# EAGLE design AK4558EN_PMOD (EAGLE 9.6.1)

## Sheet 1 of 2
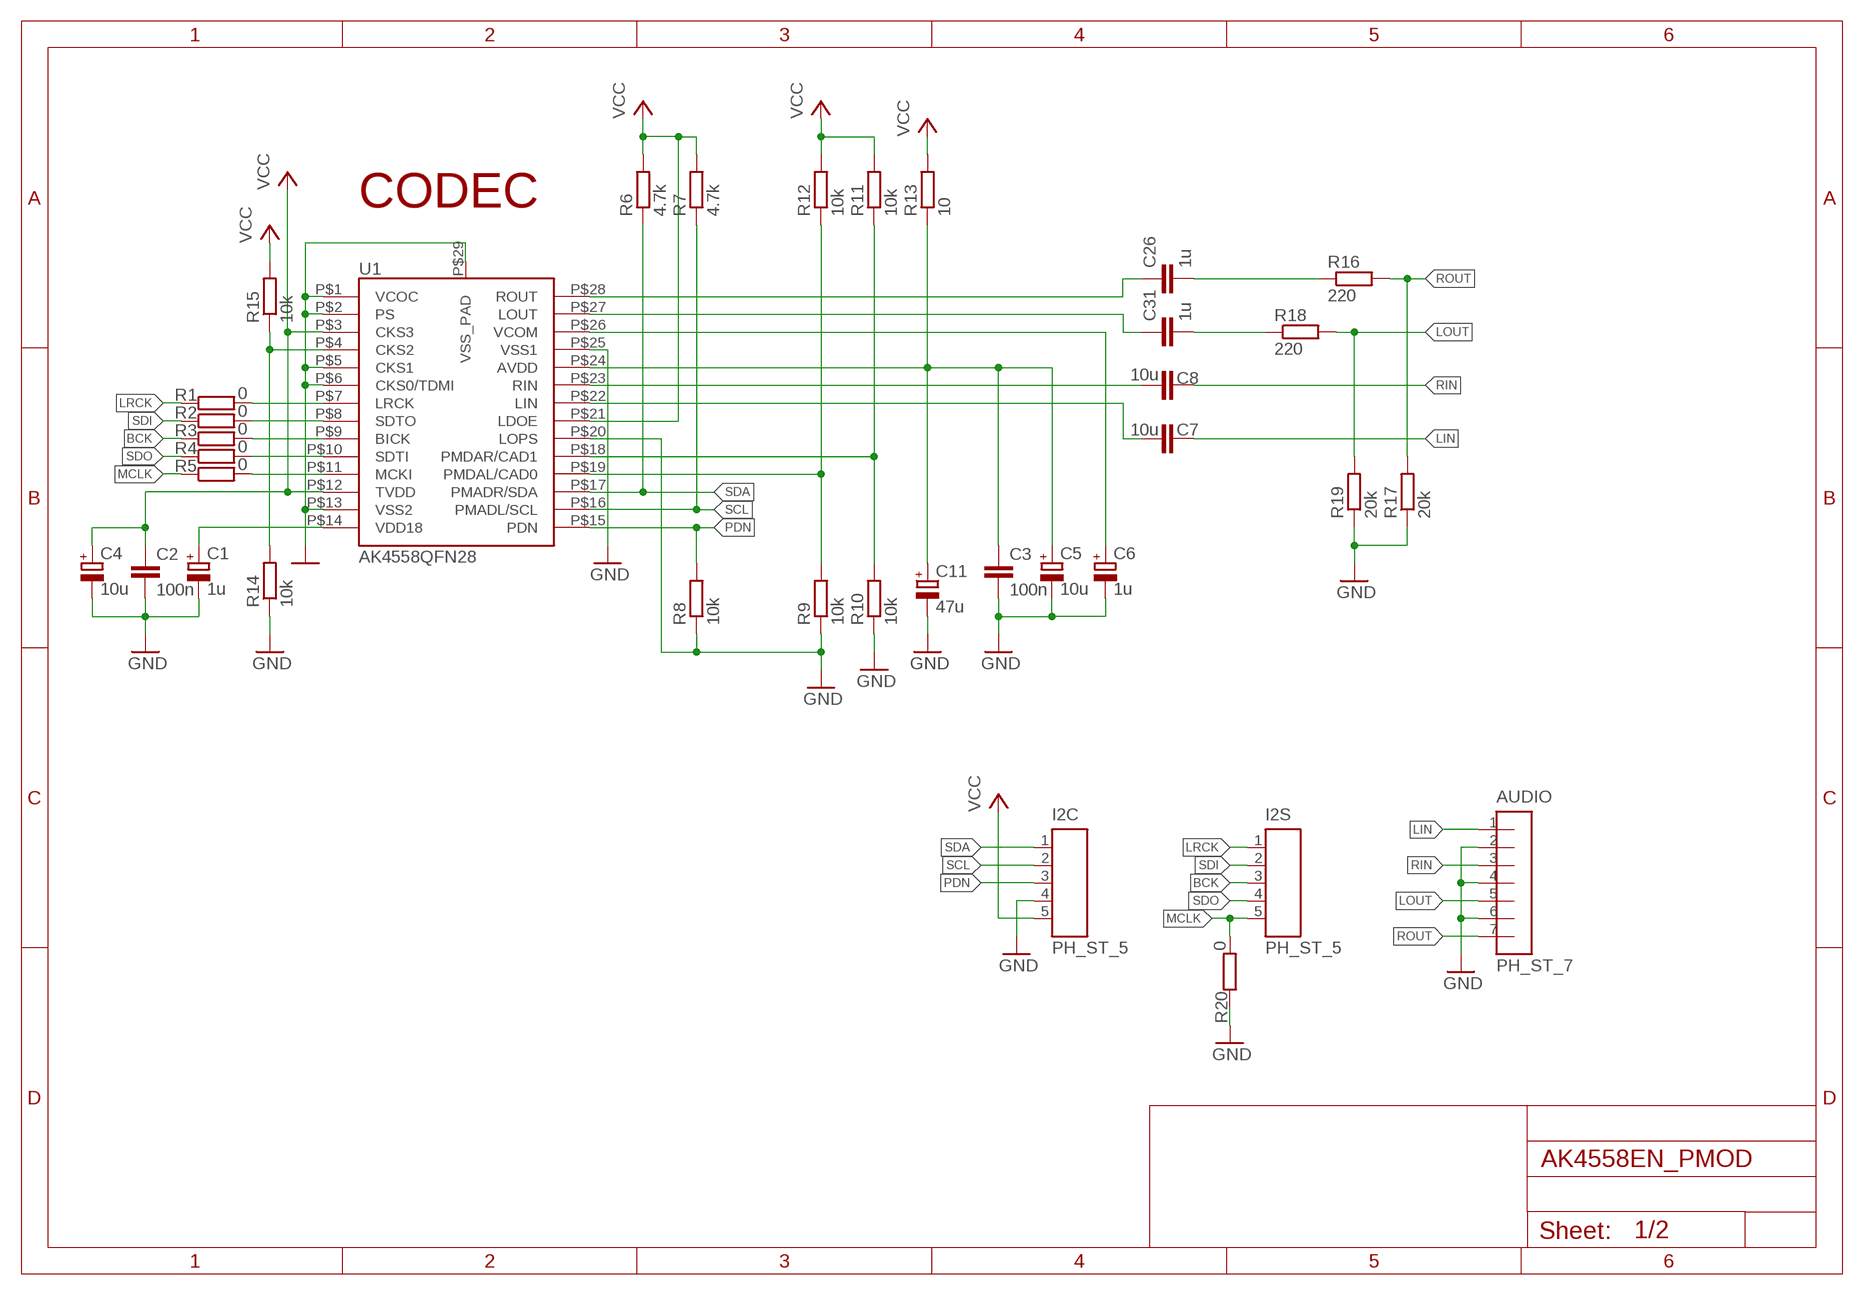
[diagram p0: schematic, sheet 1]

### Parts
AUDIO  PH_ST_7  [HDRV7W64P254_1X7_1016X508X838B]
C1  1u  CPOL-EUSMCA  [SMC_A]
C2  100n  C-EUC0603  [C0603]
C3  100n  C-EUC0603  [C0603]
C4  10u  CPOL-EUSMCB  [SMC_B]
C5  10u  CPOL-EUSMCB  [SMC_B]
C6  1u  CPOL-EUSMCA  [SMC_A]
C7  10u  C-EUC0603  [C0603]
C8  10u  C-EUC0603  [C0603]
C11  47u  CPOL-EUSMCC  [SMC_C]
C26  1u  C-EUC0603  [C0603]
C31  1u  C-EUC0603  [C0603]
I2C  PH_ST_5  [HDRV5W64P254_1X5_1016X508X838B]
I2S  PH_ST_5  [HDRV5W64P254_1X5_1016X508X838B]
R1  0  R-EU_R0603  [R0603]
R2  0  R-EU_R0603  [R0603]
R3  0  R-EU_R0603  [R0603]
R4  0  R-EU_R0603  [R0603]
R5  0  R-EU_R0603  [R0603]
R6  4.7k  R-EU_R0603  [R0603]
R7  4.7k  R-EU_R0603  [R0603]
R8  10k  R-EU_R0603  [R0603]
R9  10k  R-EU_R0603  [R0603]
R10  10k  R-EU_R0603  [R0603]
R11  10k  R-EU_R0603  [R0603]
R12  10k  R-EU_R0603  [R0603]
R13  10  R-EU_R0603  [R0603]
R14  10k  R-EU_R0603  [R0603]
R15  10k  R-EU_R0603  [R0603]
R16  220  R-EU_R0603  [R0603]
R17  20k  R-EU_R0603  [R0603]
R18  220  R-EU_R0603  [R0603]
R19  20k  R-EU_R0603  [R0603]
R20  0  R-EU_R0603  [R0603]
U1  AK4558QFN28  [QFN28_5X5]

### Nets
BCK: I2S.3 R3.1
CKS2: R14.2 R15.1 U1.P$4(CKS2)
CODEC_AVDD: C3.1 C5.+ C11.+ R13.1 U1.P$24(AVDD)
GND: AUDIO.2 AUDIO.4 AUDIO.6 C1.- C2.2 C3.2 C4.- C5.- C6.- C11.- I2C.4 R8.1 R9.1 R10.1 R14.1 R17.1 R19.1 R20.1 U1.P$1(VCOC) U1.P$2(PS) U1.P$5(CKS1) U1.P$6(CKS0/TDMI) U1.P$13(VSS2) U1.P$20(LOPS) U1.P$25(VSS1) U1.P$29(VSS_PAD)
LIN: AUDIO.1 C7.1
LOUT: AUDIO.5 R18.2 R19.2
LRCK: I2S.1 R1.1
MCLK: I2S.5 R5.1 R20.2
N$2: C7.2 U1.P$22(LIN)
N$3: C26.2 R16.1
N$4: C6.+ U1.P$26(VCOM)
N$5: R5.2 U1.P$11(MCKI)
N$6: C8.2 U1.P$23(RIN)
N$7: C31.1 U1.P$27(LOUT)
N$8: C31.2 R18.1
N$9: C26.1 U1.P$28(ROUT)
N$10: R10.2 R11.1 U1.P$18(PMDAR/CAD1)
N$11: R9.2 R12.1 U1.P$19(PMDAL/CAD0)
N$15: C1.+ U1.P$14(VDD18)
N$22: R1.2 U1.P$7(LRCK)
N$27: R2.2 U1.P$8(SDTO)
N$28: R3.2 U1.P$9(BICK)
N$30: R4.2 U1.P$10(SDTI)
PDN: I2C.3 R8.2 U1.P$15(PDN)
RIN: AUDIO.3 C8.1
ROUT: AUDIO.7 R16.2 R17.2
SCL: I2C.2 R7.1 U1.P$16(PMADL/SCL)
SDA: I2C.1 R6.1 U1.P$17(PMADR/SDA)
SDI: I2S.2 R2.1
SDO: I2S.4 R4.1
VCC: C2.1 C4.+ I2C.5 R6.2 R7.2 R11.2 R12.2 R13.2 R15.2 U1.P$3(CKS3) U1.P$12(TVDD) U1.P$21(LDOE)

### Notes on the sheet
- CODEC

## Sheet 2 of 2: ANALOG
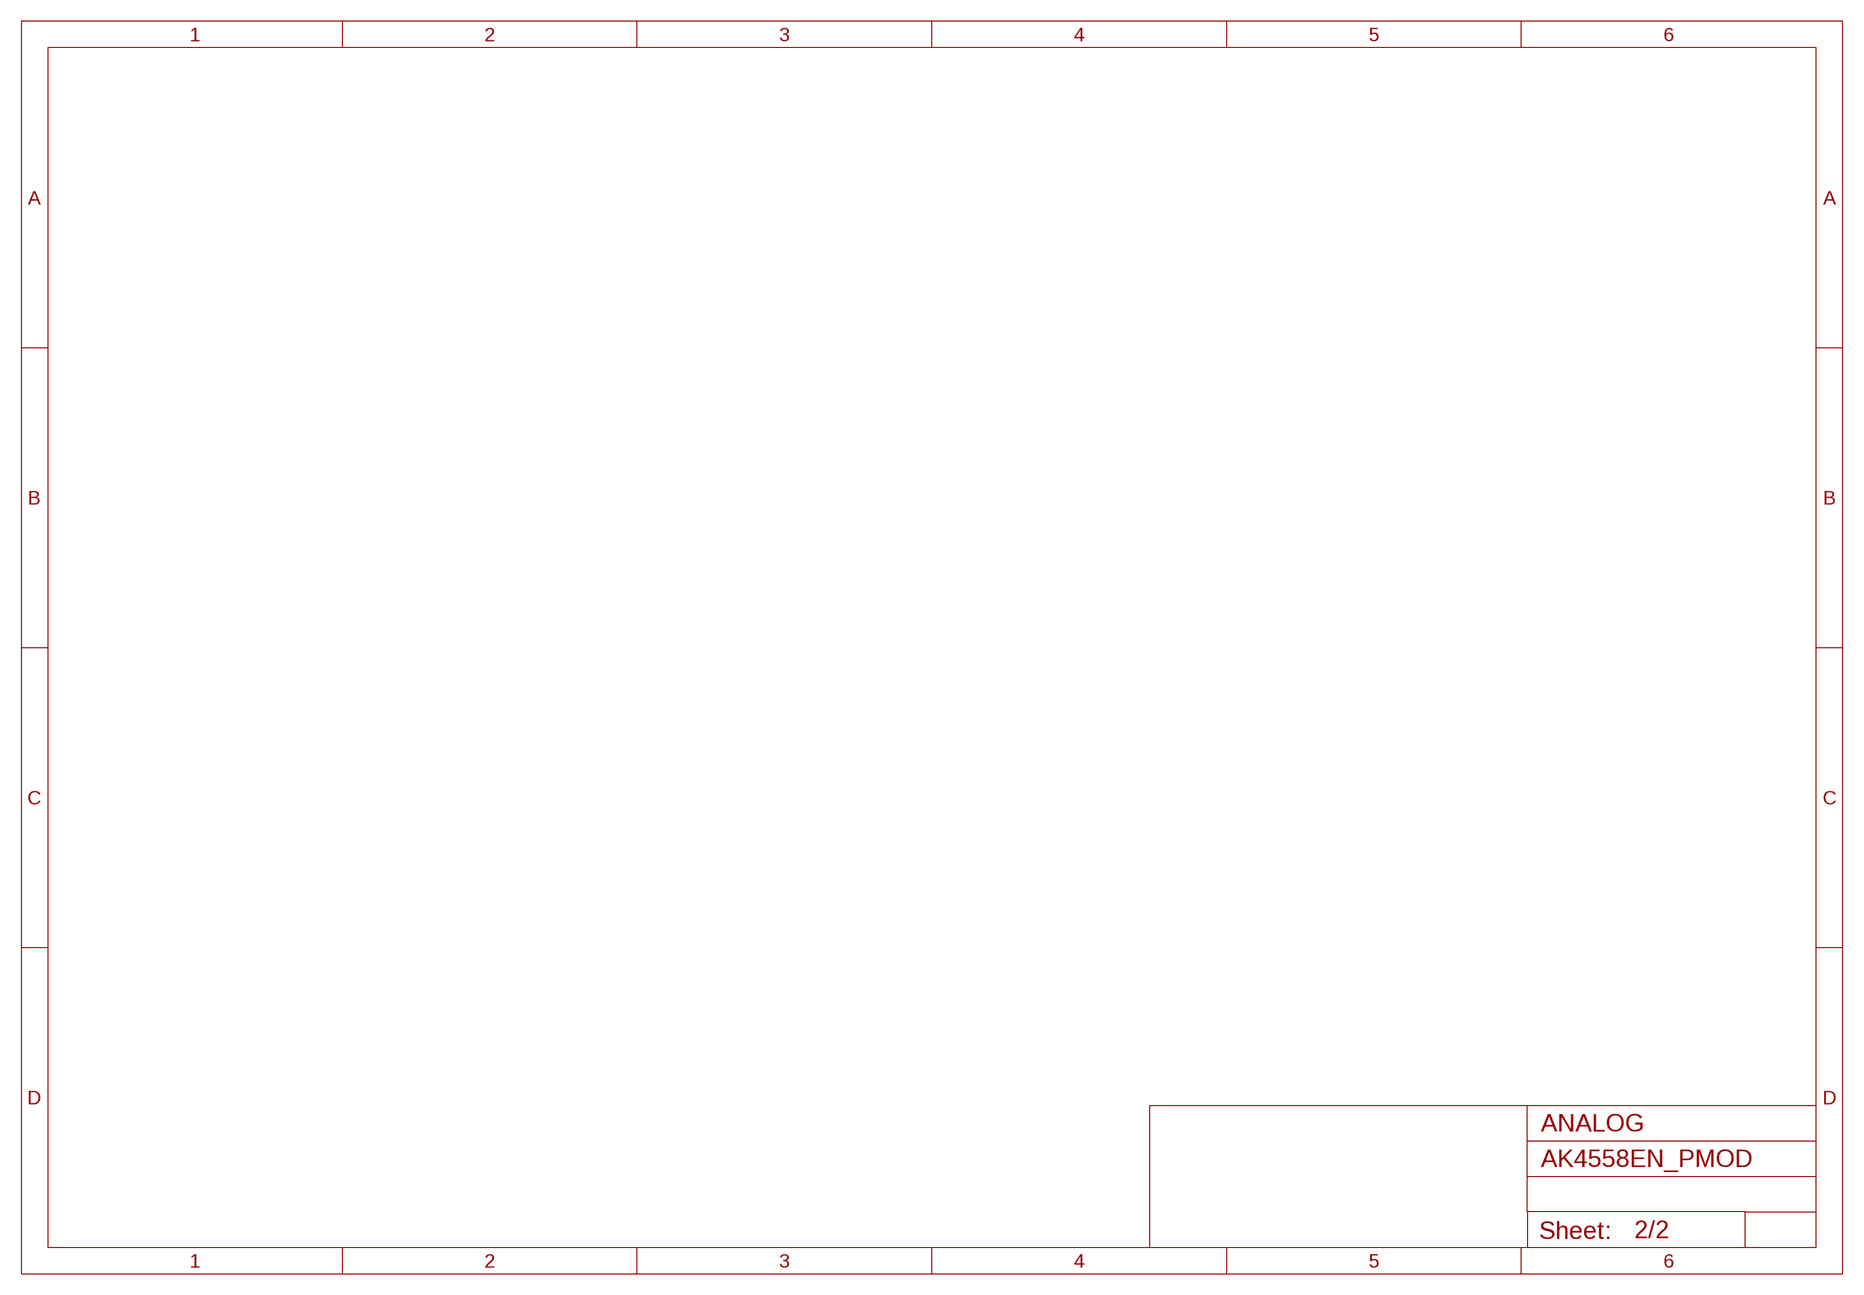
[diagram p1: schematic, sheet 2]

## Library data of the parts
AUDIO = AK4558EN_PMOD:PH_ST_7
C1 C4-C6 C11 = NuLib:CPOL-EU: POLARIZED CAPACITOR, European symbol; SPICEPREFIX: C
C2 C3 C7 C8 C26 C31 = rcl:C-EU: CAPACITOR, European symbol; SPICEPREFIX: C
I2C I2S = AK4558EN_PMOD:PH_ST_5
R1-R20 = rcl:R-EU_: RESISTOR, European symbol; SPICEPREFIX: R
U1 = HRA:AK4558

## Board
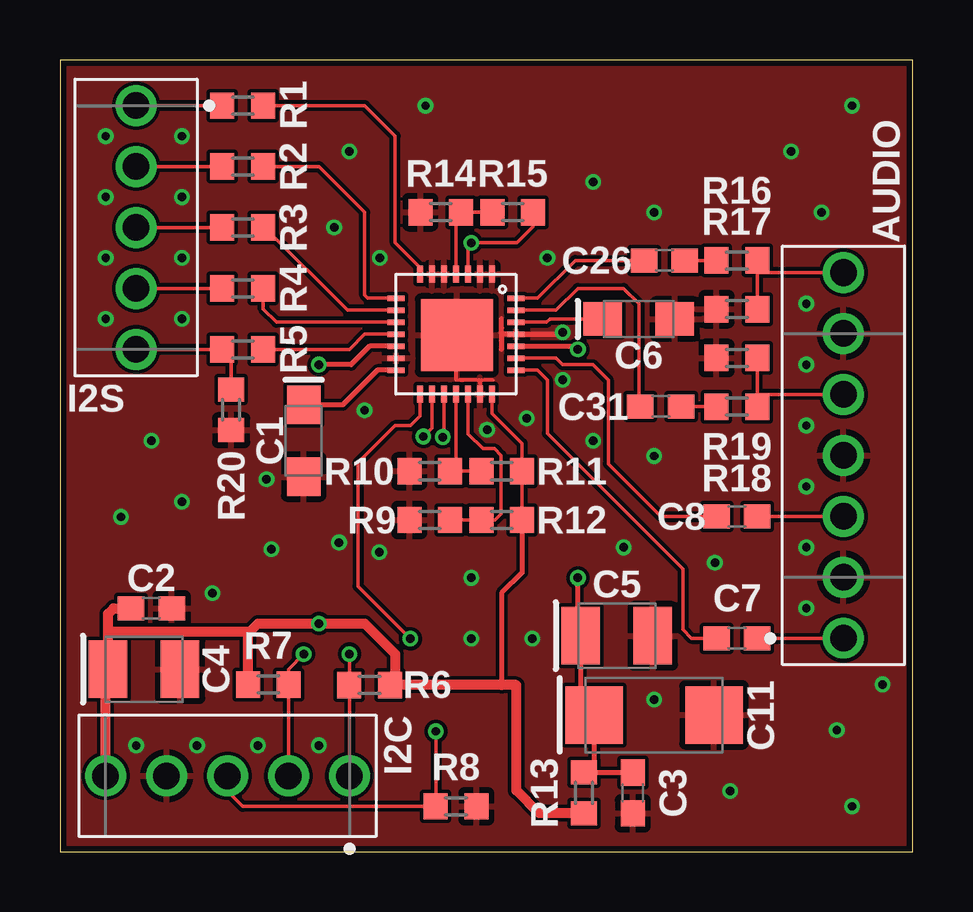
[diagram p2: board, top side]
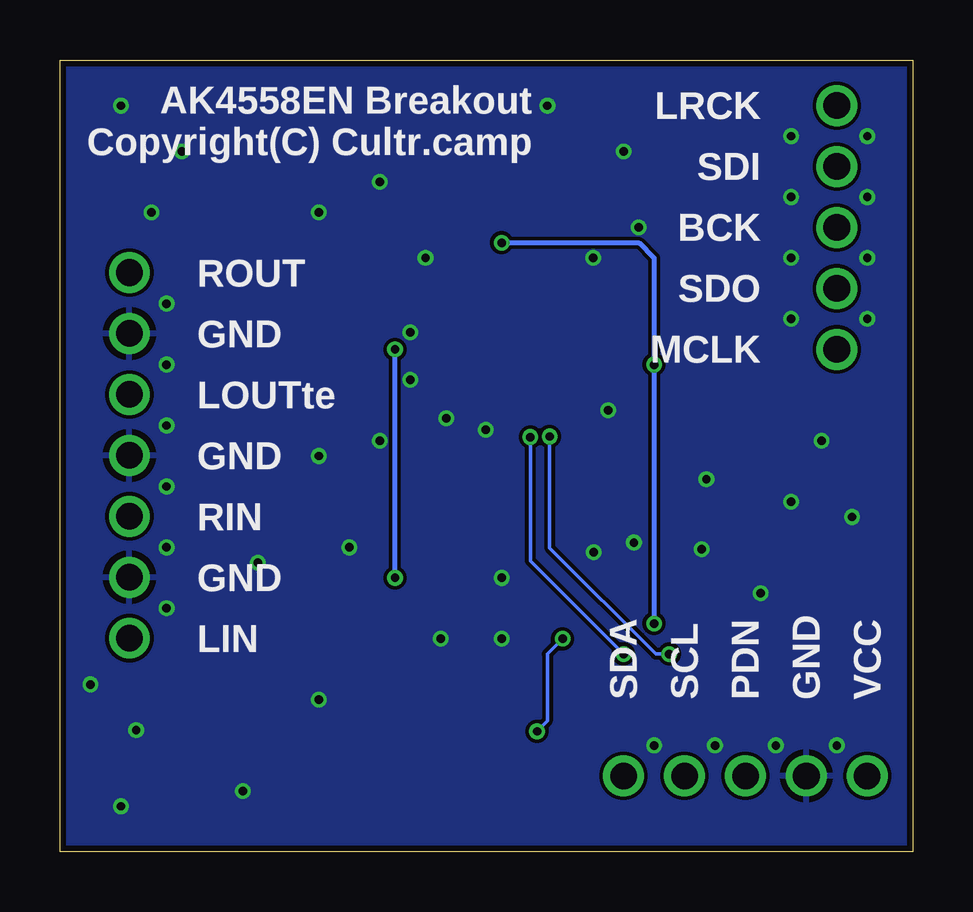
[diagram p3: board, bottom side, seen from below]

Size 35.56 x 33.02 mm. Coordinates in mm from the lower left corner, seen from the top.
Outline: 0,0 35.56,0 35.56,33.02 0,33.02 0,0
Copper layers (1*16): Top 0.035mm / dielectric 1.5mm / Bottom 0.035mm
Design rules "SeeedStudio_2layer_DRU_no_angle_20140221": minimum track width 6mil, minimum drill 12mil, track to track 6mil, track to pad 6mil, pad to pad 6mil, via to via 6mil, smd to smd 0mil, copper to edge 10mil, drill to drill 10mil, minimum pad ring 10mil, minimum via ring 6mil, stop-mask expansion 2mil, vias tented up to drill 100mil, thermal gap 10mil

### Footprints (pad centres in the part's own frame; a part is rotated, then mirrored left to right if it is on the bottom)
HDRV7W64P254_1X7_1016X508X838B = drill 1.105 pad 1.705: 1 0,0; 2 2.54,0; 3 5.08,0; 4 7.62,0; 5 10.16,0; 6 12.7,0; 7 15.24,0
SMC_A = smd 1.6 x 1.4: + -1.5,0; - 1.5,0
C0603 = smd 1.1 x 1: 1 -0.85,0; 2 0.85,0
SMC_B = smd 1.6 x 2.4: + -1.5,0; - 1.5,0
SMC_C = smd 2.4 x 2.4: + -2.5,0; - 2.5,0
HDRV5W64P254_1X5_1016X508X838B = drill 1.105 pad 1.705: 1 0,0; 2 2.54,0; 3 5.08,0; 4 7.62,0; 5 10.16,0
R0603 = smd 1 x 1.1: 1 -0.85,0; 2 0.85,0
QFN28_5X5 = smd 0.7 x 0.23: P$1 -2.5,1.5; P$2 -2.5,1; P$3 -2.5,0.5; P$4 -2.5,0; P$5 -2.5,-0.5; P$6 -2.5,-1; P$7 -2.5,-1.5; P$15 2.5,-1.5; P$16 2.5,-1; P$17 2.5,-0.5; P$18 2.5,0; P$19 2.5,0.5; P$20 2.5,1; P$21 2.5,1.5 | smd 0.23 x 0.7: P$8 -1.5,-2.5; P$9 -1,-2.5; P$10 -0.5,-2.5; P$11 0,-2.5; P$12 0.5,-2.5; P$13 1,-2.5; P$14 1.5,-2.5; P$22 1.5,2.5; P$23 1,2.5; P$24 0.5,2.5; P$25 0,2.5; P$26 -0.5,2.5; P$27 -1,2.5; P$28 -1.5,2.5 | smd 3 x 3: P$29 0.04,0.04

### Placement (x,y rotation side)
AUDIO  32.66,8.92 90 top
C1  10.16,17.14 270 top
C2  3.81,10.16 0 top
C3  23.88,2.46 270 top
C4  3.51,7.62 0 top
C5  23.22,9.02 0 top
C6  24.13,22.23 0 top
C7  28.22,8.92 180 top
C8  28.22,14 180 top
C11  24.77,5.71 0 top
C26  25.2,24.66 0 top
C31  25.04,18.57 0 top
I2C  12.06,3.17 180 top
I2S  3.17,31.11 270 top
R1  7.62,31.11 0 top
R2  7.62,28.57 0 top
R3  7.62,26.04 0 top
R4  7.62,23.5 0 top
R5  7.62,20.95 0 top
R6  12.9,6.96 0 top
R7  8.69,6.99 180 top
R8  16.51,1.91 180 top
R9  15.42,13.84 0 top
R10  15.42,15.88 0 top
R11  18.41,15.88 0 top
R12  18.41,13.84 0 top
R13  21.84,2.46 270 top
R14  15.88,26.67 0 top
R15  18.87,26.67 0 top
R16  28.22,24.66 0 top
R17  28.22,22.63 0 top
R18  28.22,18.57 0 top
R19  28.22,20.6 0 top
R20  7.14,18.44 90 top
U1  16.51,21.59 270 top

### Tracks (layer width: path | path; a pad name or v marks a point on that pad's centre or on a via)
BCK
  Top 0.152: R3.1 I2S.3
CKS2
  Top 0.152: U1.P$4 16.51,26.45 R14.2 R15.1
CODEC_AVDD  (via drill 0.35)
  Top 0.203: R13.1 22.23,3.31 | 22.23,3.31 C3.1 | 22.23,3.31 22.27,3.35 C11.+ 21.72,6.26 C5.+ 21.59,9.14 v21.59,11.43 | v21.59,20.95 21.46,21.08 U1.P$24
  Bottom 0.203: v21.59,11.43 v21.59,20.95
GND  (via drill 0.35)
  Top 0.152: U1.P$20 17.51,19.65 | 17.51,19.65 17.48,19.68 16.51,19.68 16.51,21.51 U1.P$29 | 17.51,19.65 17.53,19.67 18.06,19.67
  Top 0.203: v20.95,21.66 20.88,21.59 U1.P$25 18.41,21.59 | 18.41,21.59 18.41,21.32 18.41,21.31 18.41,20.95 | 18.41,21.59 18.41,21.86 18.41,21.87 18.41,22.23
  other vias: 17.81,17.6 17.14,11.43 13.31,12.5 11.63,12.9 8.81,12.62 5.08,14.61 3.81,17.14 2.54,13.97 6.35,10.79 3.17,4.45 5.71,4.45 8.26,4.45 10.79,4.45 5.08,22.23 5.08,24.77 5.08,27.3 5.08,29.84 1.91,29.84 1.91,27.3 1.91,24.77 1.91,22.23 11.43,26.04 12.06,29.21 15.24,31.11 22.23,27.94 24.77,26.67 30.48,29.21 31.75,26.67 33.02,31.11 31.11,22.86 31.11,20.32 31.11,17.78 31.11,15.24 31.11,12.7 31.11,10.16 27.3,12.06 24.77,16.51 23.5,12.7 19.68,8.89 32.38,5.08 27.94,2.54 33.02,1.91 34.29,6.99 24.77,6.35 17.14,8.89 22.23,17.14 20.95,19.68 19.46,18.08 12.7,18.41 8.61,15.54 13.34,24.77 20.32,24.77
  pour Top (isolate 0.152): 0,0 0,33.02 35.56,33.02 35.56,0
  pour Bottom (isolate 0.152): 0,0 0,34.29 35.56,34.29 35.56,0
LIN
  Top 0.152: C7.1 AUDIO.1
LOUT
  Top 0.152: R18.2 29.07,19.07 | 29.07,19.07 R19.2 | AUDIO.5 29.07,19.07
LRCK
  Top 0.152: R1.1 I2S.1
MCLK
  Top 0.152: I2S.5 R5.1 7.14,20.59 R20.2
N$2
  Top 0.152: U1.P$22 19.91,20.09 20.32,19.68 20.32,17.45 25.96,11.81 25.96,9.27 26.31,8.91 C7.2
N$3
  Top 0.152: C26.2 R16.1
N$4
  Top 0.152: U1.P$26 20.29,22.09 20.42,22.23 C6.+
N$5
  Top 0.152: U1.P$11 12.7,21.59 12.06,20.95 R5.2
N$6
  Top 0.152: U1.P$23 20.68,20.59 20.95,20.32 22.23,20.32 22.86,19.68 22.86,16.18 25.04,13.99 C8.2
N$7
  Top 0.152: U1.P$27 20.68,22.59 21.59,23.5 23.5,23.5 24.13,22.86 24.13,19.05 24.19,18.99 C31.1
N$8
  Top 0.152: C31.2 R18.1
N$9
  Top 0.152: U1.P$28 19.91,23.09 21.49,24.66 C26.1
N$10
  Top 0.152: R11.1 R10.2 16.51,16.12 U1.P$18
N$11
  Top 0.152: R9.2 R12.1 18.14,13.84 18.39,14.1 18.39,16.54 18.11,16.82 17.63,16.82 17.01,17.43 U1.P$19
N$15
  Top 0.203: U1.P$14 13.23,20.09 11.79,18.64 C1.+
N$22
  Top 0.152: U1.P$7 15.01,24.36 13.97,25.4 13.97,29.84 12.7,31.11 R1.2
N$27
  Top 0.152: U1.P$8 12.83,23.09 12.7,23.22 12.7,26.67 10.79,28.57 R2.2
N$28
  Top 0.152: U1.P$9 11.98,22.59 8.53,26.04 R3.2
N$30
  Top 0.152: U1.P$10 9.03,22.09 8.47,22.64 R4.2
PDN  (via drill 0.35)
  Top 0.152: I2C.3 6.99,2.54 7.62,1.91 R8.2 15.67,1.92 v15.67,5.03 | U1.P$15 15.01,18.18 14.61,17.78 13.97,17.78 12.42,16.23 12.42,11.07 v14.61,8.89
  Bottom 0.152: v15.67,5.03 15.24,5.46 15.24,8.26 v14.61,8.89
RIN
  Top 0.152: C8.1 AUDIO.3
ROUT
  Top 0.152: R16.2 29.07,24.16 | 29.07,24.16 R17.2 | AUDIO.7 29.07,24.16
SCL  (via drill 0.35)
  Top 0.152: I2C.2 9.53,6.97 | 9.53,6.97 R7.1 | v10.16,8.26 9.53,7.62 9.53,6.97 | U1.P$16 15.51,17.69 v15.15,17.32
  Bottom 0.152: v10.16,8.26 10.72,8.26 15.15,12.68 v15.15,17.32
SDA  (via drill 0.35)
  Top 0.152: v12.06,8.26 12.06,6.97 R6.1 12.06,6.95 I2C.1 | v15.95,17.3 15.95,17.55 16.01,17.61 U1.P$17
  Bottom 0.152: v12.06,8.26 15.95,12.14 v15.95,17.3
SDI
  Top 0.152: R2.1 I2S.2
SDO
  Top 0.152: R4.1 I2S.4
VCC  (via drill 0.35)
  Top 0.152: U1.P$3 17.01,25.4 v17.14,25.4 19.05,25.4 19.72,26.07 R15.2 | U1.P$21 18.01,18.29 19.27,17.03 R11.2 R12.2
  Top 0.203: U1.P$12 12.91,21.09 12.14,20.32 v10.79,20.32 | R12.2 19.27,11.64 18.41,10.79 18.41,6.96
  Top 0.406: I2C.5 1.91,7.52 C4.+ 2,9.21 | 2,9.21 2,9.93 2.23,10.16 C2.1 | 7.93,9.21 8.26,9.53 v10.79,9.53 12.7,9.53 13.97,8.26 13.97,7.18 R6.2 18.41,6.96 19.02,6.96 19.02,2.56 19.98,1.61 R13.2 | 2,9.21 7.93,9.21 | R7.2 7.84,9.11 7.93,9.21
  Bottom 0.203: v10.79,9.53 v10.79,20.32 10.79,24.77 11.43,25.4 v17.14,25.4

### Text on the board
bPlace: LRCK | AK4558EN Breakout / Copyright(C) Cultr.camp | SDI | BCK | ROUT | SDO | GND | MCLK | LOUTte | GND | RIN | GND | LIN | VCC | GND | PDN | SCL | SDA